# Altium schematic sheet simple_motor_driver.SchDoc
size A; SheetNumber: 1; SheetTotal: 1
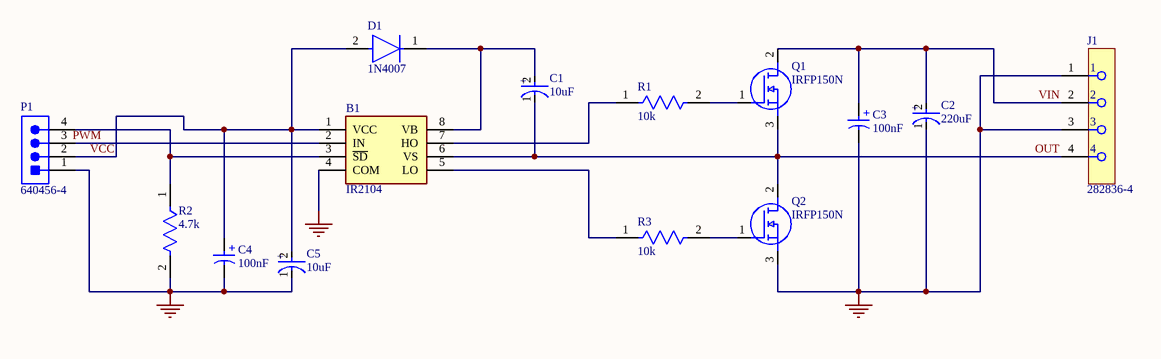
[diagram p0: simple_motor_driver.SchDoc]

## Parts
B1  IR2104  [DIP762W56P254L988H533Q8N]
C1  10uF  [FP-RAD-TH-D_16_0_5-L_25_2-MFG]
C2  220uF  [FP-RAD-TH-D_16_0_5-L_25_2-MFG]
C3  100nF  [WCAP-ATLL_D8H11.5]
C4  100nF  [WCAP-ATLL_D8H11.5]
C5  10uF  [FP-RAD-TH-D_16_0_5-L_25_2-MFG]
D1  1N4007  [FP-1N4007-MFG]
J1  282836-4  [FP-282836-4-MFG]
P1  640456-4  [TECO-640456-4]
Q1  IRFP150N  [TO545P530X1560X2460-3P]
Q2  IRFP150N  [TO545P530X1560X2460-3P]
R1  10k  [FP-CF14-MFG]
R2  4.7k  [FP-CF14-MFG]
R3  10k  [FP-CF14-MFG]

## Nets
GND: B1.4(COM) C2.1(C) C3.2(N) C4.2(N) C5.1(C) J1.1 J1.3 P1.1 Q2.3(S) R2.2
OUT: B1.6(VS) C1.1(C) J1.4 Q1.3(S) Q2.2(D)
PWM: B1.2(IN) P1.3
VCC: B1.1(VCC) C4.1(P) C5.2(A) D1.2(A) P1.2
VIN: C2.2(A) C3.1(P) J1.2 Q1.2(D)
NetB1_3: B1.3(~{SD}) P1.4 R2.1
NetB1_5: B1.5(LO) R3.1
NetB1_7: B1.7(HO) R1.1
NetB1_8: B1.8(VB) C1.2(A) D1.1(C)
NetQ1_1: Q1.1(G) R1.2
NetQ2_1: Q2.1(G) R3.2

## Notes on the sheet
- (in symbol CMP-03913-53914461-1) +
- (in symbol CMP-05427-001116-1) +

## Library data of the parts
B1 = IR2104: Single MOSFET DRIVER, 8 Pin, Plastic, DIP; Manufacturer_Name: Infineon; Geometry.Height: 5.33mm; Manufacturer_Part_Number: IR2104; Mouser Part Number: *; Mouser Price/Stock: *; Arrow Part Number: *; Arrow Price/Stock: *; Datasheet Link: http://uk.rs-online.com/web/p/products/2456067; Supplier 1: Allied Electronics; Supplier Part Number 1: 70017128
C1 C2 C5 = CMP-05427-001116-1: Aluminum Electrolytic Capacitors (Radial Lead Type) 47uF ±20% 400V; Ripple Current (AC): 1.18A; Dissipation Factor: 0.24%; Dielectric Material: Aluminium; Life (Hours): 10000Hour; Lead Diameter: 0.8mm; Leakage Current: 1.138mA; Mount: Through Hole; Diameter: 16mm; Number of Pins: 2; Capacitance: 47uF; Package Quantity: 100; Voltage: 400V; Voltage Rating (DC): 400V; Max Operating Temperature: 105°C; Termination: Radial; Case/Package: Radial; Lead Free: Lead Free; Construction: RADIAL; Lead Pitch: 7.5mm; Series: EE; Tolerance: 20%; Length: 25mm; RoHS Compliant: Yes; Ripple Current: 1.18A; Height - Seated (Max): 0.984inch; Radiation Hardening: No; Height: 25mm; Voltage Rating: 400V; Packaging: Bulk; Min Operating Temperature: -25°C; REACH SVHC: No SVHC
C3 C4 = CMP-03913-53914461-1: 860160574013 WCAP-ATLL Aluminum Electrolytic Capacitors; Pitch: 3.5mm; Ripple Current: 414mA; Voltage Rating (DC): 35V; Tolerance: 20%; Life (Hours): 7000hours; Capacitance: 100µF; Material: Aluminium; Leakage Current: 35µA; Length: 11.5mm; Case/Package: Radial; Min Operating Temperature: -55°C; Max Operating Temperature: 105°C; REACH SVHC: Unknown; NexarPartId: 53914461; Height: 11.5mm; RoHS: Non-Compliant; Diameter: 8mm; Voltage Rating: 35V; Lead Pitch: 3.5mm
D1 = CMP-123542-000001-1: Rectifier diode 1000 V 1 A DO-41, ,; Manufacturer: Diotec; Max Surge Forward Current: 27A; Forward Current: 1A; Max Junction Temp: +175°C; Reverse Voltage: 1000V; Value: 15pF; Peak Reverse Current: 5uA; Category: Diode; Temperature Range Low: -50°C; Automotive: No; Temperature: -50°C to +175°C; Lead Free: Yes; ComponentLink2Description: Datasheet; Max Repetitive Reverse Voltage: 1000V; ComponentLink2URL: https://datasheet.octopart.com/1N4007-Diotec-datasheet-62346875.pdf; Manufacturer Part Number: 1N4007; Device Class L3: Rectifier Diodes; Height: 2.8mm; Octopart: https://octopart.com/1n4007-diotec-4040411; Package: 1N4007; Temperature Range High: +175°C; Device Class L1: Discrete Semiconductors; Device Class L2: Diodes; RoHS: TRUE; Capacitance: 15pF; Ipc Land Pattern Name: DIOAD888W100L520D280
J1 = CMP-03790-46505329-1: 282836-4 Connector, Terminal Block; Wire Receptacle; 4 Pos.; 16-30 AWG; 0.197 in. CL; Sid; Manufacturer Lifecycle Status: ACTIVE; Number of Contacts: 4; Max Supply Voltage (AC): 300V; Wire Gauge (Min): 30AWG; Max Current Rating: 13.5A; Approvals: UL; Number of Levels: 1; Thread Size: M3; Connector System: Wire-to-Board; Voltage Rating (DC): 250V; Pitch: 5mm; Plating: Brass; Tail Length: 3.5mm; Housing Color: Green; Number of Rows: 1; REACH SVHC: Unknown; Lead Pitch: 5mm; Depth: 8.2mm; Lead Free: Lead Free; Mount: Through Hole; Contact Plating: Tin; Housing Material: Polyamide; ELV: Compliant; Radiation Hardening: No; RoHS: Compliant; Number of Circuits: 4; Voltage Rating: 300V; Contact Material: Brass; NexarPartId: 46505329; Current Rating: 13.5A; Max Voltage Rating (AC): 300V; Orientation: Straight; Number of Positions: 4; Lifecycle Status: Production; Operating Supply Voltage: 300V; Connector Type: Receptacle; Number of Positions Per Level: 4; Flammability Rating: UL94 V-0; Packaging: Bulk; Termination: Screw, Solder; Wire Gauge (Max): 30AWG; Number of Poles: 4; Width: 10mm; Voltage Rating (AC): 250V; Length: 20mm; Current: 13.5A; Voltage: 300V; Color: Green
P1 = CMP-2000-05419-1: Male Header, Pitch 2.54 mm, 1 x 4 Position, Height 10.03 mm, Tail Length 3.56 mm, RoHS, Bulk; Manufacturer: TE Connectivity; Material, Housing: Polyester; Primary Type: InterconnectSystem; Mount Angle: Vertical; Color, Housing: White; Current, Rating: 5 / A; Agency Approvals: CSA,UL; Contact Termination Area Plating: Tin; Temperature, Operating: -55to+105 / degC; Standards: RoHSCompliant,ELVCompliant,UL94V-0; Number of Positions: 4; Brand/Series: MTA-100Series; Angle: Straight; Pin Spacing: 0.1 / "; Material, Contact: CopperAlloy; Connector Type: MTA-100; Special Features: Pinstrip; Mounting Hole Size: 0.04 / "; Contact Centerline Spacing: 0.100 / in.; Voltage, Rating: 250 / V; Manufacturer URL: http://www.te.com/; Length, Pin: 0.14 / "; Length, Overall: 0.4 / "; Color: White; Flammability Rating: UL94V-0; Mounting Type: PCMount; Termination: Solder; Datasheet URL: https://datasheet.ciiva.com/16286/eng-ds-82056-mta-0608-16286228.pdf; Number of Contacts: 4; Contact Shape: Square; Contact Mating Area Plating: Tin; Length, Terminal Post: 0.14 / in.; Size, Post: 0.025 / in.; Contact Plating: Tin; Type: PCBPlug; Datasheet Version: Dec-14; Number of Rows: 1
Q1 Q2 = IRFP150N: N-channel MOSFET,IRFP150N 42A 100V; Manufacturer_Name: Infineon; Geometry.Height: 5.3mm; Manufacturer_Part_Number: IRFP150N; Mouser Part Number: N/A; Mouser Price/Stock: https://www.mouser.co.uk/ProductDetail/Infineon-IR/IRFP150N?qs=Gkr2N%2F2q3o1s6Jt6X18FEA%3D%3D; Arrow Part Number: *; Arrow Price/Stock: *; Datasheet Link: http://www.infineon.com/dgdl/irfp150n.pdf?fileId=5546d462533600a40153562867fa1fd4
R1-R3 = CMP-26528-000003-1: RES 7.5K OHM 1/4W 5% AXIAL; Max Power Dissipation: 250mW; Temperature Coefficient: -400ppm/°C; Resistance: 7.5kR; RoHS Compliant: Yes; Lead Free: Lead Free; Max Operating Temperature: 155°C; Case/Package: Axial; Tolerance: 5%; Power Rating: 250mW; Diameter: 2.3mm; Features: Flame Retardant Coating; Series: CF; Resistor Type: Carbon Film; Number of Terminations: 2; Length: 0.256inch; Min Operating Temperature: -55°C; Contact Plating: Tin; Packaging: Tape and Reel; Mount: Through Hole; Radiation Hardening: No